# Altium schematic sheet FPGA_CFG_EEM.SchDoc: =P_Title
size 420 x 297 mm; EDA_Number: ARTIQ; Projet: ARTIQ/SINARA; Author: G.Kasprowicz; CompanyName: WUT ISE; DrawnBy: G.Kasprowicz; Organization: WUT ISE; Address1: PW ISE; Address2: Nowowiejska 15/19 00-665 Warsaw; Address3: gkasprow@gmail.com; DocumentNumber: 4; Revision: 2; SheetNumber: 4; ModifiedBy: -; CheckedDate: -; Title2: FPGA ADC; DivGrp: WUT ISE; Designer: G.Kasprowicz; ModifiedDate: -; ProjectName: Sensor Box
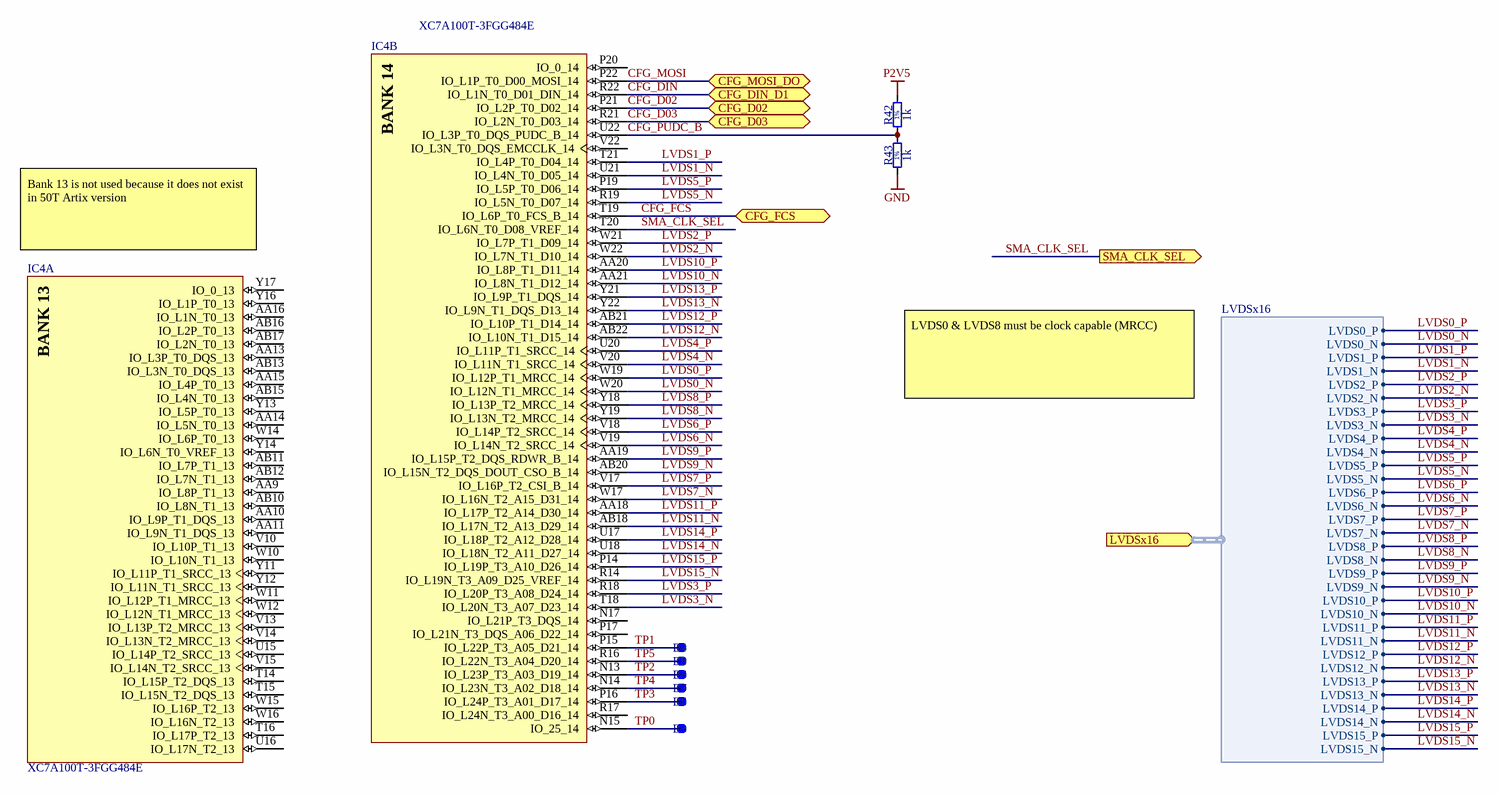
[diagram p0: FPGA_CFG_EEM.SchDoc]

## Parts
B3  SMD Pad  [C100]  (value not drawn)
B4  SMD Pad  [C100]  (value not drawn)
B5  SMD Pad  [C100]  (value not drawn)
B6  SMD Pad  [C100]  (value not drawn)
B7  SMD Pad  [C100]  (value not drawn)
B8  SMD Pad  [C100]  (value not drawn)
IC4  XC7A100T-3FGG484E  [FGG484]  (parts A,B of 10)
R42  1k  [RESC1005X40N]
R43  1k  [RESC1005X40N]

## Ports
CFG_D02 (bidir), CFG_D03 (bidir), CFG_DIN_D1 (bidir), CFG_FCS (bidir), CFG_MOSI_DO (bidir), LVDSx16 (in, harness LVDSx16), SMA_CLK_SEL (out)

## Harnesses
LVDSx16: LVDS0_P, LVDS0_N, LVDS1_P, LVDS1_N, LVDS2_P, LVDS2_N, LVDS3_P, LVDS3_N, LVDS4_P, LVDS4_N, LVDS5_P, LVDS5_N, LVDS6_P, LVDS6_N, LVDS7_P, LVDS7_N, LVDS8_P, LVDS8_N, LVDS9_P, LVDS9_N, LVDS10_P, LVDS10_N, LVDS11_P, LVDS11_N, LVDS12_P, LVDS12_N, LVDS13_P, LVDS13_N, LVDS14_P, LVDS14_N, LVDS15_P, LVDS15_N

## Nets
GND: R43.1
P2V5: R42.2
CFG_D02: IC4.P21(IO_L2P_T0_D02_14) ; port CFG_D02
CFG_D03: IC4.R21(IO_L2N_T0_D03_14) ; port CFG_D03
CFG_DIN: IC4.R22(IO_L1N_T0_D01_DIN_14) ; port CFG_DIN_D1
CFG_FCS: IC4.T19(IO_L6P_T0_FCS_B_14) ; port CFG_FCS
CFG_MOSI: IC4.P22(IO_L1P_T0_D00_MOSI_14) ; port CFG_MOSI_DO
CFG_PUDC_B: IC4.U22(IO_L3P_T0_DQS_PUDC_B_14) R42.1 R43.2
LVDS0_N: IC4.W20(IO_L12N_T1_MRCC_14) ; port LVDSx16.LVDS0_N
LVDS0_P: IC4.W19(IO_L12P_T1_MRCC_14) ; port LVDSx16.LVDS0_P
LVDS1_N: IC4.U21(IO_L4N_T0_D05_14) ; port LVDSx16.LVDS1_N
LVDS1_P: IC4.T21(IO_L4P_T0_D04_14) ; port LVDSx16.LVDS1_P
LVDS2_N: IC4.W22(IO_L7N_T1_D10_14) ; port LVDSx16.LVDS2_N
LVDS2_P: IC4.W21(IO_L7P_T1_D09_14) ; port LVDSx16.LVDS2_P
LVDS3_N: IC4.T18(IO_L20N_T3_A07_D23_14) ; port LVDSx16.LVDS3_N
LVDS3_P: IC4.R18(IO_L20P_T3_A08_D24_14) ; port LVDSx16.LVDS3_P
LVDS4_N: IC4.V20(IO_L11N_T1_SRCC_14) ; port LVDSx16.LVDS4_N
LVDS4_P: IC4.U20(IO_L11P_T1_SRCC_14) ; port LVDSx16.LVDS4_P
LVDS5_N: IC4.R19(IO_L5N_T0_D07_14) ; port LVDSx16.LVDS5_N
LVDS5_P: IC4.P19(IO_L5P_T0_D06_14) ; port LVDSx16.LVDS5_P
LVDS6_N: IC4.V19(IO_L14N_T2_SRCC_14) ; port LVDSx16.LVDS6_N
LVDS6_P: IC4.V18(IO_L14P_T2_SRCC_14) ; port LVDSx16.LVDS6_P
LVDS7_N: IC4.W17(IO_L16N_T2_A15_D31_14) ; port LVDSx16.LVDS7_N
LVDS7_P: IC4.V17(IO_L16P_T2_CSI_B_14) ; port LVDSx16.LVDS7_P
LVDS8_N: IC4.Y19(IO_L13N_T2_MRCC_14) ; port LVDSx16.LVDS8_N
LVDS8_P: IC4.Y18(IO_L13P_T2_MRCC_14) ; port LVDSx16.LVDS8_P
LVDS9_N: IC4.AB20(IO_L15N_T2_DQS_DOUT_CSO_B_14) ; port LVDSx16.LVDS9_N
LVDS9_P: IC4.AA19(IO_L15P_T2_DQS_RDWR_B_14) ; port LVDSx16.LVDS9_P
LVDS10_N: IC4.AA21(IO_L8N_T1_D12_14) ; port LVDSx16.LVDS10_N
LVDS10_P: IC4.AA20(IO_L8P_T1_D11_14) ; port LVDSx16.LVDS10_P
LVDS11_N: IC4.AB18(IO_L17N_T2_A13_D29_14) ; port LVDSx16.LVDS11_N
LVDS11_P: IC4.AA18(IO_L17P_T2_A14_D30_14) ; port LVDSx16.LVDS11_P
LVDS12_N: IC4.AB22(IO_L10N_T1_D15_14) ; port LVDSx16.LVDS12_N
LVDS12_P: IC4.AB21(IO_L10P_T1_D14_14) ; port LVDSx16.LVDS12_P
LVDS13_N: IC4.Y22(IO_L9N_T1_DQS_D13_14) ; port LVDSx16.LVDS13_N
LVDS13_P: IC4.Y21(IO_L9P_T1_DQS_14) ; port LVDSx16.LVDS13_P
LVDS14_N: IC4.U18(IO_L18N_T2_A11_D27_14) ; port LVDSx16.LVDS14_N
LVDS14_P: IC4.U17(IO_L18P_T2_A12_D28_14) ; port LVDSx16.LVDS14_P
LVDS15_N: IC4.R14(IO_L19N_T3_A09_D25_VREF_14) ; port LVDSx16.LVDS15_N
LVDS15_P: IC4.P14(IO_L19P_T3_A10_D26_14) ; port LVDSx16.LVDS15_P
SMA_CLK_SEL: IC4.T20(IO_L6N_T0_D08_VREF_14) ; port SMA_CLK_SEL
TP0: B3.1 IC4.N15(IO_25_14)
TP1: B4.1 IC4.P15(IO_L22P_T3_A05_D21_14)
TP2: B5.1 IC4.N13(IO_L23P_T3_A03_D19_14)
TP3: B6.1 IC4.P16(IO_L24P_T3_A01_D17_14)
TP4: B7.1 IC4.N14(IO_L23N_T3_A02_D18_14)
TP5: B8.1 IC4.R16(IO_L22N_T3_A04_D20_14)

Not connected (* = marked no-connect by the designer): IC4 AA9(IO_L8P_T1_13) AA10(IO_L9P_T1_DQS_13) AA11(IO_L9N_T1_DQS_13) AA13(IO_L3P_T0_DQS_13) AA14(IO_L5N_T0_13) AA15(IO_L4P_T0_13) AA16(IO_L1N_T0_13) AB10(IO_L8N_T1_13) AB11(IO_L7P_T1_13) AB12(IO_L7N_T1_13) AB13(IO_L3N_T0_DQS_13) AB15(IO_L4N_T0_13) AB16(IO_L2P_T0_13) AB17(IO_L2N_T0_13) N17(IO_L21P_T3_DQS_14) P17(IO_L21N_T3_DQS_A06_D22_14) P20(IO_0_14) R17(IO_L24N_T3_A00_D16_14) T14(IO_L15P_T2_DQS_13) T15(IO_L15N_T2_DQS_13) T16(IO_L17P_T2_13) U15(IO_L14P_T2_SRCC_13) U16(IO_L17N_T2_13) V10(IO_L10P_T1_13) V13(IO_L13P_T2_MRCC_13) V14(IO_L13N_T2_MRCC_13) V15(IO_L14N_T2_SRCC_13) V22(IO_L3N_T0_DQS_EMCCLK_14) W10(IO_L10N_T1_13) W11(IO_L12P_T1_MRCC_13) W12(IO_L12N_T1_MRCC_13) W14(IO_L6P_T0_13) W15(IO_L16P_T2_13) W16(IO_L16N_T2_13) Y11(IO_L11P_T1_SRCC_13) Y12(IO_L11N_T1_SRCC_13) Y13(IO_L5P_T0_13) Y14(IO_L6N_T0_VREF_13) Y16(IO_L1P_T0_13) Y17(IO_0_13)

## Notes on the sheet
- (near IC4) Bank 13 is not used because it does not exist in 50T Artix version
- LVDS0 & LVDS8 must be clock capable (MRCC)
- Project/Equipment
- Document
- Designer
- Drawn by
- Check.by
- Copyright WUT ISE 2018.
  This documentation describes Open Hardware and is licensed under the CERN OHL v.1.1. You may redistribute and modify this documentation under the terms of the CERN OHL v.1.1. (http://ohwr.org/CERNOHL). This documentation is distributed WITHOUT ANY EXPRESS OR IMPLIED WARRANTY, INCLUDING OF MERCHANTABILITY, SATISFACTORY QUALITY AND FITNESS FOR A PARTICULAR PURPOSE. Please see the CERN OHL v.1.1 for applicable conditions.
- Contact
- File
- Last Mod.
- Print Date
- Sheet
- Size
- A3
- of
- Rev
- (in symbol CMP-0364-00028-3, part A) BANK 13
- (in symbol CMP-0364-00028-3, part B) BANK 14
- (in symbol R0402_1K_1%_0.0625W_100PPM) 1%

## Library data of the parts
B3-B8 = SMD_PAD_D1MM: Through Hole Pad; Part Description: 1mm Diameter SMD Pad; Mounted: No; Part Number: SMD_PAD_D1MM; Component Kind: Standard (No BOM); Component Type: Standard (No BOM); Pin Count: 1; Family: SMD Pad; Socket: No; SMD: No; Sense: No; Status: None; ComponentHeight: 0mm; HelpURL: Undefined; Author: CERN DEM JLC; CreateDate: 10.10.2017; LatestRevisionDate: 10.10.2017; PackageDescription: 1mm Diameter SMD Pad
IC4 = CMP-0364-00028-3: Artix-7 FPGA, 285 User I/Os, 4 GTP, 484-Ball BGA, Speed Grade 3, Extended Grade, Pb-Free; Manufacturer: Xilinx; Max User I/O: 300; Clock Mgmt Tiles (CMTs): 6; Logic Cells: 101440; Block RAM Blocks (36Kb): 135; Block RAM Blocks (18Kb): 270; Speed Grade: -3; CLBs (Slices): 15850; Block RAM Blocks (Max Kb): 4860; DSP48E1 Slices: 240; RoHS: Pb-Free; ComponentLink3URL: http://www.xilinx.com/support/documentation/data_sheets/ds181_Artix_7_Data_Sheet.pdf; NexusDeviceID: XC7A100T-3FGG484E; DatasheetVersion: v1.12; Mounting Technology: Surface Mount; PackageDescription: Wire-Bond Fine-Pitch BGA, Body 23 x 23 mm, 1.0 mm Pitch; PackageReference: FGG484; ComponentLink2Description: Package Specification; Code_JEDEC: MS-034-AAJ-1; ComponentLink2URL: http://www.xilinx.com/support/documentation/user_guides/ug475_7Series_Pkg_Pinout.pdf; ComponentLink3Description: DC and Switching Characteristics; Generic Part Number: XC7A100T; ComponentLink4Description: Package File; ComponentLink4URL: http://www.xilinx.com/support/packagefiles/a7packages/xc7a100tfgg484pkg.txt; ComponentLink1URL: http://www.xilinx.com/support/documentation/data_sheets/ds180_7Series_Overview.pdf; PartNumber: XC7A100T-3FGG484E; ComponentLink5URL: http://www.xilinx.com/support/documentation/user_guides/ug475_7Series_Pkg_Pinout.pdf; PackageVersion: Rev 1.8; ComponentLink5Description: Packaging and Pinout; ComponentLink1Description: Datasheet; CLBs (Max Distributed RAM Kb): 1188
R42 R43 = R0402_1K_1%_0.0625W_100PPM: Resistor - 1%; Part Description: General Purpose Thick Film Chip Resistor; Manufacturer: GENERIC; Manufacturer1 Part Number: 232270671002L; TC: ±100ppm/°C; PressFit: No; Part Number: R0402_1K_1%_0.0625W_100PPM; Component Kind: Standard; Component Type: Standard; Pin Count: 2; Value: 1k; Status: Not Recommended; Power: 0.0625W; Tolerance: ±1%; Manufacturer Part Number: R0402_1K_1%_0.0625W_100PPM; Case: 0402; Mounted: Yes; Sense: No; Socket: No; SMD: Yes; Manufacturer1 Example: YAGEO PHYCOMP; Manufacturer1 ComponentHeight: 0.4mm; HelpURL: \\cern.ch\dfs\Applications\Altium\Datasheets\R0402_Phycomp_RC0402.pdf; Author: CERN DEM JLC; CreateDate: 03.12.2007; LatestRevisionDate: 17.10.2012; ClassName: Artix